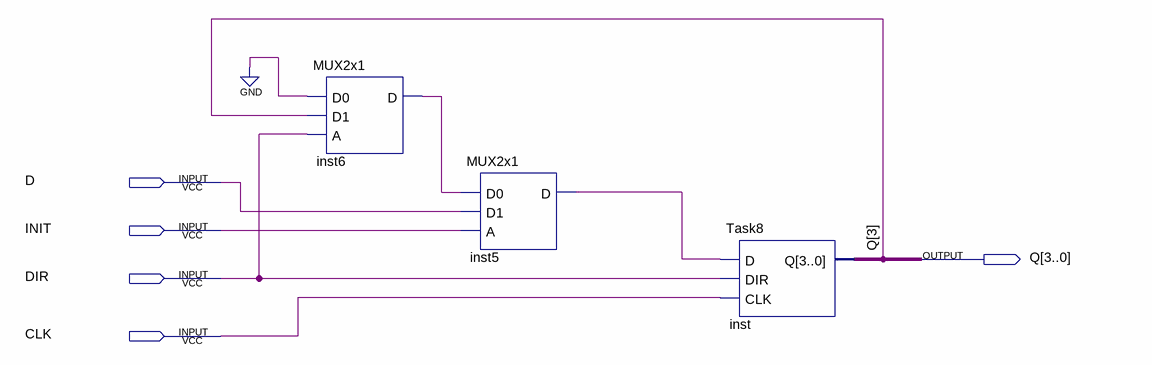
[diagram p0: schematic sheet]
// Quartus schematic Task8AlgShifter.bdf as structural Verilog: 3 symbols, 5 pins
module Task8AlgShifter (
  input  D,
  input  INIT,
  input  DIR,
  input  CLK,
  output [3:0] Q
);

  wire inst5_d, inst6_d;

  MUX2x1 inst6 (.D0(1'b0), .D1(Q[3]), .A(DIR), .D(inst6_d));
  MUX2x1 inst5 (.D0(inst6_d), .D1(D), .A(INIT), .D(inst5_d));
  Task8 inst (.D(inst5_d), .DIR(DIR), .CLK(CLK), .Q(Q));
endmodule
